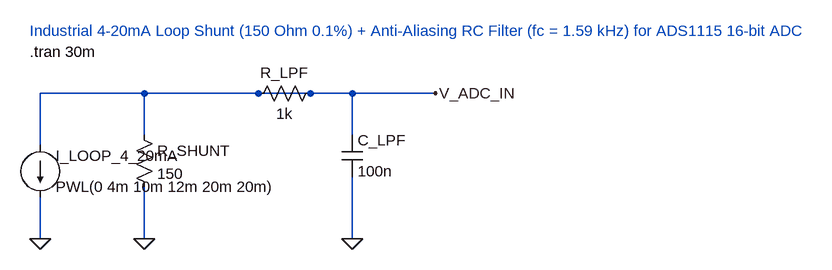
[diagram p0: schematic Industrial_4_20mA_Analog_Frontend.asc]
Industrial_4_20mA_Analog_Frontend.asc, the LTspice schematic file:
Version 4
SHEET 1 1200 800
WIRE 160 160 160 240
WIRE 160 160 320 160
WIRE 320 160 320 224
WIRE 320 160 480 160
WIRE 480 160 640 160
WIRE 640 160 640 224
WIRE 640 160 768 160
WIRE 160 320 160 384
WIRE 320 304 320 384
WIRE 640 288 640 384
FLAG 160 384 0
FLAG 320 384 0
FLAG 640 384 0
FLAG 768 160 V_ADC_IN
SYMBOL current 160 240 R0
WINDOW 0 24 16 Left 2
WINDOW 3 24 64 Left 2
SYMATTR InstName I_LOOP_4_20mA
SYMATTR Value PWL(0 4m 10m 12m 20m 20m)
SYMBOL res 304 208 R0
SYMATTR InstName R_SHUNT
SYMATTR Value 150
SYMBOL res 592 144 R90
WINDOW 0 0 56 VBottom 2
WINDOW 3 32 56 VTop 2
SYMATTR InstName R_LPF
SYMATTR Value 1k
SYMBOL cap 624 224 R0
SYMATTR InstName C_LPF
SYMATTR Value 100n
TEXT 144 96 Left 2 !.tran 30m
TEXT 144 64 Left 2 ;Industrial 4-20mA Loop Shunt (150 Ohm 0.1%) + Anti-Aliasing RC Filter (fc = 1.59 kHz) for ADS1115 16-bit ADC

The netlist it stands for:
* Industrial_4_20mA_Analog_Frontend.asc
I_LOOP_4_20mA V_ADC_IN 0 PWL(0 4m 10m 12m 20m 20m)
R_SHUNT V_ADC_IN 0 150
R_LPF V_ADC_IN V_ADC_IN 1k
C_LPF V_ADC_IN 0 100n
.tran 30m
* Industrial 4-20mA Loop Shunt (150 Ohm 0.1%) + Anti-Aliasing RC Filter (fc = 1.59 kHz) for ADS1115 16-bit ADC
.backanno
.end